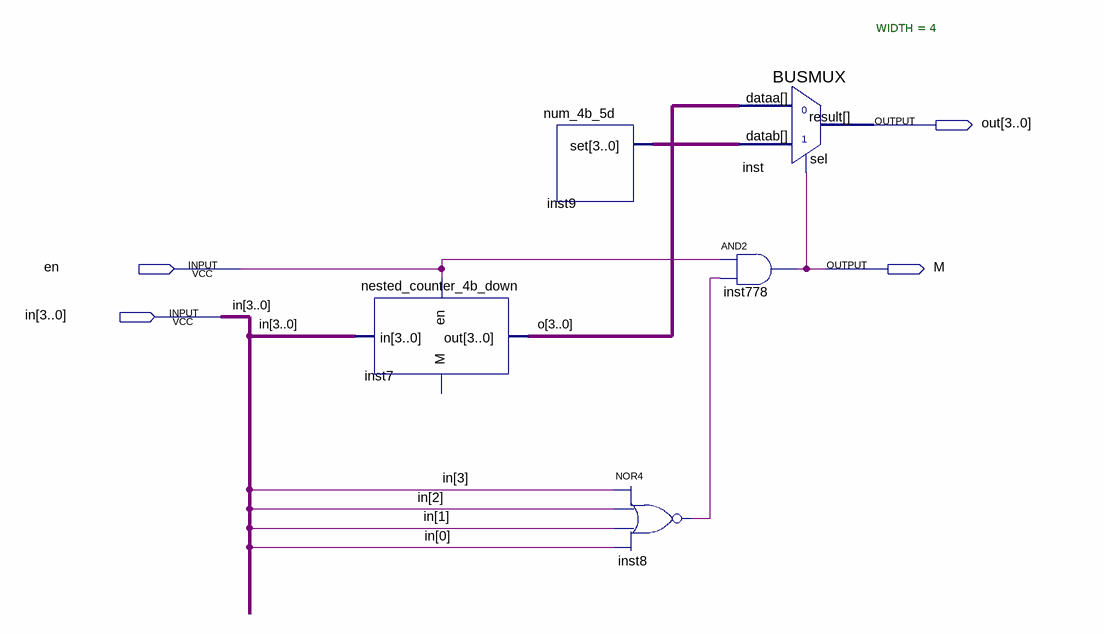
[diagram p0: schematic sheet]
// Quartus schematic nested_counter_6d_down.bdf as structural Verilog: 5 symbols, 4 pins
module nested_counter_6d_down (
  input  en,
  input  [3:0] in,
  output [3:0] out,
  output M
);

  wire inst8_out;
  wire [3:0] inst9_set, o;

  nested_counter_4b_down inst7 (.en(en), .in(in), .out(o));  // open: M
  num_4b_5d inst9 (.set(inst9_set));
  nor inst8 (inst8_out, in[3], in[2], in[1], in[0]);
  and inst778 (M, en, inst8_out);
  BUSMUX #(.WIDTH(4)) inst (.datab(inst9_set), .sel(M), .dataa(o), .result(out));
endmodule
